# Altium schematic sheet MCU.SchDoc
size A4
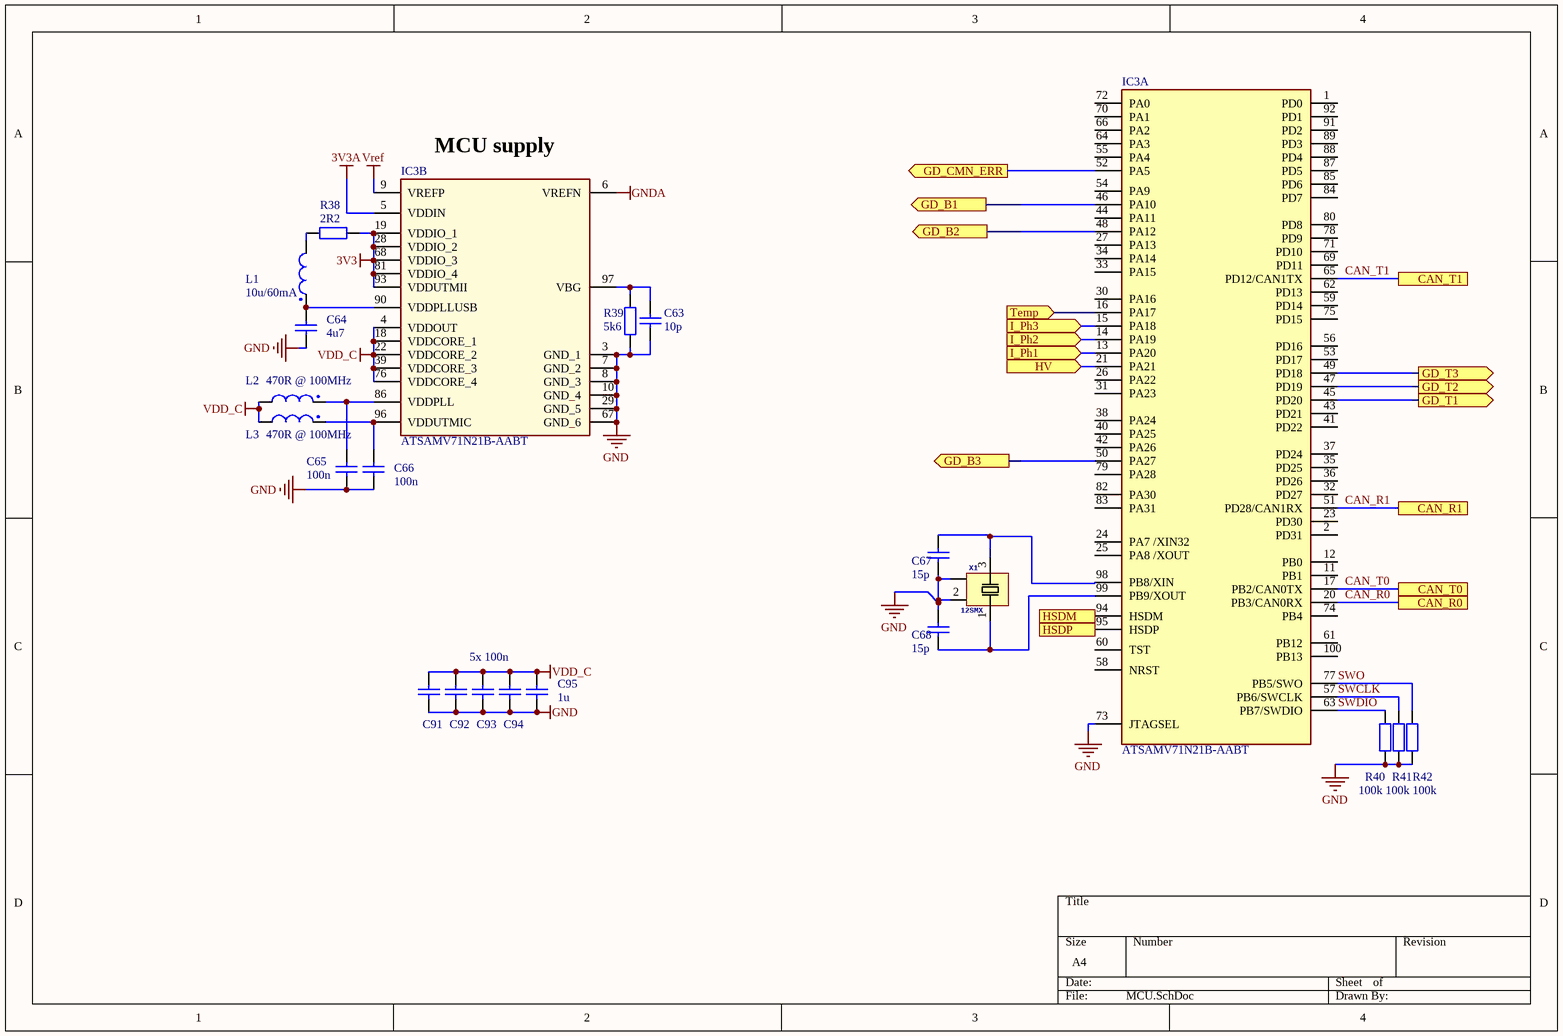
[diagram p0: MCU.SchDoc]

## Parts
C63  10p  [C_0603]
C64  4u7  [C_0805]
C65  100n  [C_0603]
C66  100n  [C_0603]
C67  15p  [C_0603]
C68  15p  [C_0603]
C91  100n  [C_0603]  (value not drawn)
C92  100n  [C_0603]  (value not drawn)
C93  100n  [C_0603]  (value not drawn)
C94  100n  [C_0603]  (value not drawn)
C95  1u  [C_0805]
IC3  ATSAMV71N21B-AABT  [QFP50P1600X1600X160-100N]  (parts A,B of 2)
L1  10u/60mA  [R_0805]
L2  470R @ 100MHz  [R_0805]
L3  470R @ 100MHz  [R_0805]
R38  2R2  [R_0603]
R39  5k6  [R_0603]
R40  100k  [R_0603]
R41  100k  [R_0603]
R42  100k  [R_0603]
X1  12SMX  [WE-XTAL_12SMX]

## Ports
CAN_R0, CAN_R1, CAN_T0, CAN_T1, GD_B1 (out), GD_B2 (out), GD_B3 (out), GD_CMN_ERR (out), GD_T1 (out), GD_T2 (out), GD_T3 (out), HSDM, HSDP, HV (in), I_Ph1 (in), I_Ph2 (in), I_Ph3 (in), Temp (in)

## Nets
3V3: IC3.19(VDDIO_1) IC3.28(VDDIO_2) IC3.68(VDDIO_3) IC3.81(VDDIO_4) IC3.93(VDDUTMII) R38.2
3V3A: IC3.5(VDDIN)
GND: C63.2 C64.1 C65.1 C66.1 C67.2 C68.1 C91.1 C92.1 C93.1 C94.1 C95.1 IC3.3(GND_1) IC3.7(GND_2) IC3.8(GND_3) IC3.10(GND_4) IC3.29(GND_5) IC3.67(GND_6) IC3.73(JTAGSEL) R39.2 R40.2 R41.2 R42.2 X1.2 X1.4
GNDA: IC3.6(VREFN)
VDD_C: C91.2 C92.2 C93.2 C94.2 C95.2 IC3.4(VDDOUT) IC3.18(VDDCORE_1) IC3.22(VDDCORE_2) IC3.39(VDDCORE_3) IC3.76(VDDCORE_4) L2.2 L3.2
Vref: IC3.9(VREFP)
CAN_R0: IC3.20(PB3/CAN0RX) ; port CAN_R0
CAN_R1: IC3.51(PD28/CAN1RX) ; port CAN_R1
CAN_T0: IC3.17(PB2/CAN0TX) ; port CAN_T0
CAN_T1: IC3.65(PD12/CAN1TX) ; port CAN_T1
GD_B1: IC3.46(PA10) ; port GD_B1
GD_B2: IC3.48(PA12) ; port GD_B2
GD_B3: IC3.50(PA27) ; port GD_B3
GD_CMN_ERR: IC3.52(PA5) ; port GD_CMN_ERR
GD_T1: IC3.45(PD20) ; port GD_T1
GD_T2: IC3.47(PD19) ; port GD_T2
GD_T3: IC3.49(PD18) ; port GD_T3
HSDM: IC3.94(HSDM) ; port HSDM
HSDP: IC3.95(HSDP) ; port HSDP
HV: IC3.21(PA21) ; port HV
I_Ph1: IC3.13(PA20) ; port I_Ph1
I_Ph2: IC3.14(PA19) ; port I_Ph2
I_Ph3: IC3.15(PA18) ; port I_Ph3
SWCLK: IC3.57(PB6/SWCLK) R41.1
SWDIO: IC3.63(PB7/SWDIO) R40.1
SWO: IC3.77(PB5/SWO) R42.1
Temp: IC3.16(PA17) ; port Temp
NetC63_1: C63.1 IC3.97(VBG) R39.1
NetC64_2: C64.2 IC3.90(VDDPLLUSB) L1.1
NetC65_2: C65.2 IC3.86(VDDPLL) L2.1
NetC66_2: C66.2 IC3.96(VDDUTMIC) L3.1
NetC67_1: C67.1 IC3.98(PB8/XIN) X1.3
NetC68_2: C68.2 IC3.99(PB9/XOUT) X1.1
NetL1_2: L1.2 R38.1

Not connected (* = marked no-connect by the designer): IC3 1(PD0) 2(PD31) 11(PB1) 12(PB0) 23(PD30) 24(PA7_/XIN32) 25(PA8_/XOUT) 26(PA22) 27(PA13) 30(PA16) 31(PA23) 32(PD27) 33(PA15) 34(PA14) 35(PD25) 36(PD26) 37(PD24) 38(PA24) 40(PA25) 41(PD22) 42(PA26) 43(PD21) 44(PA11) 53(PD17) 54(PA9) 55(PA4) 56(PD16) 58(NRST) 59(PD14) 60(TST) 61(PB12) 62(PD13) 64(PA3) 66(PA2) 69(PD11) 70(PA1) 71(PD10) 72(PA0) 74(PB4) 75(PD15) 78(PD9) 79(PA28) 80(PD8) 82(PA30) 83(PA31) 84(PD7) 85(PD6) 87(PD5) 88(PD4) 89(PD3) 91(PD2) 92(PD1) 100(PB13)

## Notes on the sheet
- (near IC3) MCU supply
- 5x 100n

## Library data of the parts
C63-C68 C91-C95 = C_MLCC: cond
  C63: Value: 10p
  C64: Value: 4u7
  C65 C66 C91-C94: Value: 100n
  C67 C68: Value: 15p
  C95: Value: 1u
IC3 = ATSAMV71N21B-AABT: Integrated Circuit; Manufacturer_Name: Microchip; Datasheet Link: http://ww1.microchip.com/downloads/en/DeviceDoc/SAM-E70S70V70V71-Family%20DataSheet-DS60001527B.pdf; Height: 1.6mm; Manufacturer_Part_Number: ATSAMV71N21B-AABT; Mouser Part Number: 556-ATSAMV71N21BAABT; Mouser Price/Stock: https://www.mouser.com/Search/Refine.aspx?Keyword=556-ATSAMV71N21BAABT
L1-L3 = L_Inductor_Choke
R38-R42 = R_Uni: Resistor
  R38: Value: 2R2
  R39: Value: 5k6
  R40-R42: Value: 100k
X1 = WE-XTAL_12SMX: WE-XTAL Quartz Crystal   Characteristics   Industry standard packages       Details see: https://katalog.we-online.com/en/pbs/WE-XTAL  Updated by Ella Wu , 2019-09-03  2019 (C) Wurth Elektronik; PART-NUMBER: 830026380; PART-NUMBER: 830026382; PART-NUMBER: 830026384; PART-NUMBER: 830026386; PART-NUMBER: 830026388; PART-NUMBER: 830026392; PART-NUMBER: 830026394; PART-NUMBER: 830026396; PART-NUMBER: 830026504; PART-NUMBER: 830059082; GateName_1: G$1; SymbolName_1: CRYSTAL-4PIN; C-LOAD: 16pF; STABILITY: 50ppm; TOLERANCE: ±30ppm; C-LOAD: 10pF; TOLERANCE: ±20ppm; LibraryName: Eagle_WE-XTAL (rev19a); DeviceSetName: WE-XTAL_12SMX; Package: WE-XTAL_12SMX; DATASHEET-URL: https://katalog.we-online.com/pbs/datasheet/830026380.pdf; MOUNT: SMT; DATASHEET-URL: https://katalog.we-online.com/pbs/datasheet/830026382.pdf; DATASHEET-URL: https://katalog.we-online.com/pbs/datasheet/830026384.pdf; DATASHEET-URL: https://katalog.we-online.com/pbs/datasheet/830026386.pdf; DATASHEET-URL: https://katalog.we-online.com/pbs/datasheet/830026388.pdf; DATASHEET-URL: https://katalog.we-online.com/pbs/datasheet/830026392.pdf; DATASHEET-URL: https://katalog.we-online.com/pbs/datasheet/830026394.pdf; DATASHEET-URL: https://katalog.we-online.com/pbs/datasheet/830026396.pdf; DATASHEET-URL: https://katalog.we-online.com/pbs/datasheet/830026504.pdf; DATASHEET-URL: https://katalog.we-online.com/pbs/datasheet/830059082.pdf